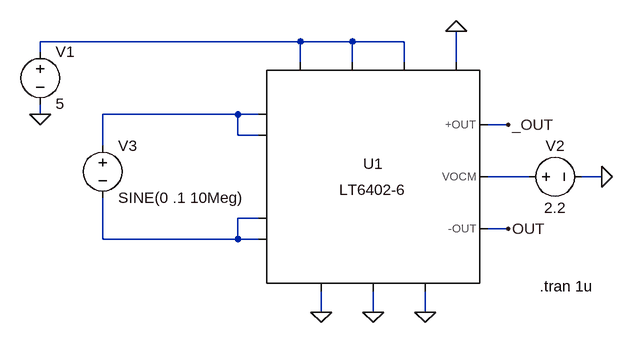
[diagram p0: schematic 6402-6.asc]
6402-6.asc, the LTspice schematic file:
Version 4
SHEET 1 880 1892
WIRE 160 304 -240 304
WIRE 240 304 160 304
WIRE 320 304 240 304
WIRE -240 320 -240 304
WIRE 160 336 160 304
WIRE 240 336 240 304
WIRE 320 336 320 304
WIRE 400 336 400 288
WIRE -240 416 -240 400
WIRE 64 416 -144 416
WIRE 96 416 64 416
WIRE 480 432 448 432
WIRE 64 448 64 416
WIRE 96 448 64 448
WIRE -144 464 -144 416
WIRE 512 512 448 512
WIRE 624 512 592 512
WIRE 96 576 64 576
WIRE 480 592 448 592
WIRE -144 608 -144 544
WIRE 64 608 64 576
WIRE 64 608 -144 608
WIRE 96 608 64 608
WIRE 192 720 192 688
WIRE 272 720 272 688
WIRE 352 720 352 688
FLAG -240 416 0
FLAG 624 512 0
FLAG 480 432 _OUT
FLAG 480 592 OUT
FLAG 400 288 0
FLAG 192 720 0
FLAG 272 720 0
FLAG 352 720 0
SYMBOL voltage -240 304 R0
SYMATTR InstName V1
SYMATTR Value 5
SYMBOL voltage 496 512 R270
WINDOW 0 32 56 VTop 2
WINDOW 3 -32 56 VBottom 2
SYMATTR InstName V2
SYMATTR Value 2.2
SYMBOL LT6402-6 272 512 R0
SYMATTR InstName U1
SYMBOL voltage -144 448 R0
SYMATTR InstName V3
SYMATTR Value SINE(0 .1 10Meg)
TEXT 528 680 Left 2 !.tran 1u

The netlist it stands for:
* 6402-6.asc
V1 N001 0 5
V2 N003 0 2.2
XU1 N001 N003 N001 0 _OUT NC_01 NC_02 OUT 0 N001 0 0 N002 N002 N004 N004 LT6402-6  ; pins ? VOCM ? ? +OUT +OUTFILT -OUTFILT -OUT ? ? ? ? ? ? ? ?
V3 N002 N004 SINE(0 .1 10Meg)
.tran 1u
.backanno
.end